# EAGLE schematic SCHEMATIC (EAGLE 9.1.0)
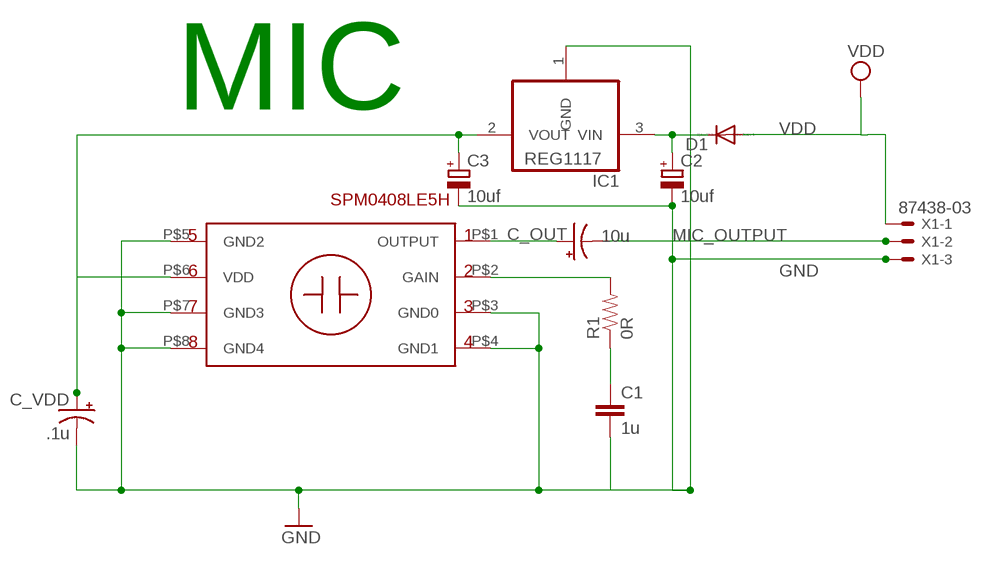
[diagram p0: schematic, sheet 1]

## Parts
C1  1u  CAP_0402  [0402]
C2  10uf  CPOL-EUD/7343-31W  [D/7343-31W]
C3  10uf  CPOL-EUD/7343-31W  [D/7343-31W]
C_OUT  10u  CAP_POL1206-KIT  [EIA3216-KIT]
C_VDD  .1u  CAP_POL1206-KIT  [EIA3216-KIT]
D1  DIODE-DO214AA  [DO214AA]
IC1  REG1117  [SOT223]
R1  0R  RES_0402  [0402]
U2  SPM0408LE5H  [SPM0408LE5H-TB]
X1  87438-03  [87438-03]

## Nets
GND: C1.2 C2.- C3.- C_VDD.C(-) IC1.1(GND) U2.P$3(GND0) U2.P$4(GND1) U2.P$5(GND2) U2.P$7(GND3) U2.P$8(GND4) X1.3
MIC_OUTPUT: C_OUT.C(-) X1.2
N$1: C2.+ D1.C IC1.3(VIN)
N$2: C3.+ C_VDD.A(+) IC1.2(VOUT) U2.P$6(VDD)
N$8: C_OUT.A(+) U2.P$1(OUTPUT)
N$35: R1.2 U2.P$2(GAIN)
N$36: C1.1 R1.1
VDD: D1.A X1.1

## Notes on the sheet
- MIC
- SPM0408LE5H

## Library data of the parts
C1 = Perfect_0402:CAP_0402: 0402 (1005 Metric) Nick Garner - TeleSense
C2 C3 = rcl:CPOL-EU: POLARIZED CAPACITOR, European symbol; SPICEPREFIX: C
C_OUT = SparkFun-Passives:CAP_POL: Capacitor Polarized These are standard SMD and PTH capacitors. Normally 10uF, 47uF, and 100uF in electrolytic and tantalum varieties. Always verify the external diameter of the through hole cap, it varies with capacity, voltage, and manufacturer. The EIA devices should be standard.; MF: AVX; MPN: 0603ZD106MAT2A; OC_FARNELL: 1867954
C_VDD = SparkFun-Passives:CAP_POL: Capacitor Polarized These are standard SMD and PTH capacitors. Normally 10uF, 47uF, and 100uF in electrolytic and tantalum varieties. Always verify the external diameter of the through hole cap, it varies with capacity, voltage, and manufacturer. The EIA devices should be standard.; MF: VISHAY SPRAGUE; MPN: 293D106X96R3A2TE3; OC_FARNELL: 1754143
D1 = diode:DIODE-: DIODE
IC1 = burr-brown:REG1117: 800mA and 1A Low Dropout (LDO) Positive Regulator 1.8V, 2.5V, 2.85V, 3.3V, 5V, and Adj; MPN: REG1117; OC_FARNELL: 1097566; OC_NEWARK: 14P6981
R1 = Perfect_0402:RES_0402: 0402 (1005 Metric) Nick Garner - TeleSense
U2 = acousticLib:SPM0408LE5H
X1 = con-molex:87438-03: Wire-to-Board 1.50mm (.059") Pitch Header - Right Angle, SMT, Shrouded Source: http://www.molex.com/product/micro/87438.html; MF: MOLEX; OC_FARNELL: 1711328; OC_NEWARK: unknown

## Net classes
0 default: width 0.152 mm, drill 0.305 mm, clearance 0.152 mm